# EAGLE design snes_visualization_joiner (EAGLE 6.4)
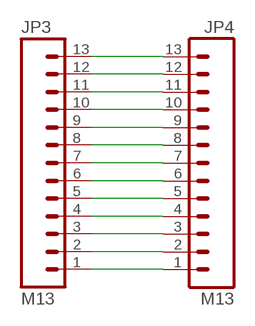
[diagram p0: schematic, sheet 1]

## Parts
JP3  M13  [1X13]
JP4  M13  [1X13]

## Nets
N$1: JP3.1 JP4.1
N$2: JP3.2 JP4.2
N$3: JP3.3 JP4.3
N$4: JP3.4 JP4.4
N$5: JP3.5 JP4.5
N$6: JP3.6 JP4.6
N$7: JP3.7 JP4.7
N$8: JP3.8 JP4.8
N$9: JP3.9 JP4.9
N$10: JP3.10 JP4.10
N$11: JP3.11 JP4.11
N$12: JP3.12 JP4.12
N$13: JP3.13 JP4.13

## Library data of the parts
JP3 JP4 = SparkFun-Connectors:M13: 13-pin single row .1" header

## Board
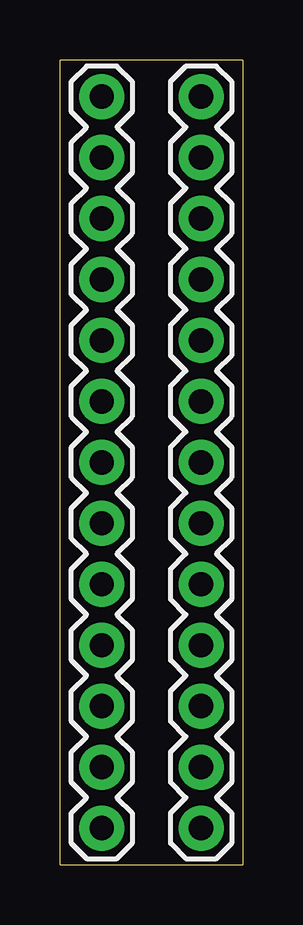
[diagram p1: board, top side]
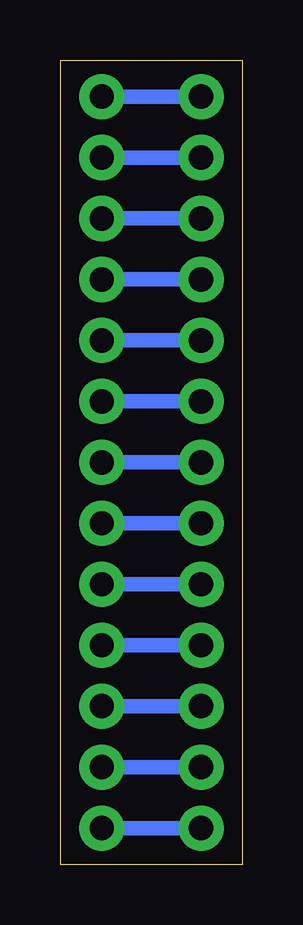
[diagram p2: board, bottom side, seen from below]

Size 7.62 x 33.53 mm. Coordinates in mm from the lower left corner, seen from the top.
Outline: 0,0 7.62,0 7.62,33.53 0,33.53 0,0
Copper layers (1*16): Top 0.035mm / dielectric 1.5mm / Bottom 0.035mm
Design rules "default": minimum track width 10mil, minimum drill 24mil, track to track 8mil, track to pad 8mil, pad to pad 8mil, via to via 8mil, smd to smd 8mil, copper to edge 40mil, drill to drill 8mil, minimum pad ring 10mil, minimum via ring 8mil, stop-mask expansion 4mil, vias tented up to drill 0mil, thermal gap 10mil

### Footprints (pad centres in the part's own frame; a part is rotated, then mirrored left to right if it is on the bottom)
1X13 = drill 1.016 pad 1.88: 1 0,0; 2 2.54,0; 3 5.08,0; 4 7.62,0; 5 10.16,0; 6 12.7,0; 7 15.24,0; 8 17.78,0; 9 20.32,0; 10 22.86,0; 11 25.4,0; 12 27.94,0; 13 30.48,0

### Placement (x,y rotation side)
JP3  1.74,1.52 90 top
JP4  5.88,1.52 90 top

### Tracks (layer width: path | path; a pad name or v marks a point on that pad's centre or on a via)
N$1
  Bottom 0.61: JP4.1 JP3.1
N$2
  Bottom 0.61: JP3.2 JP4.2
N$3
  Bottom 0.61: JP4.3 JP3.3
N$4
  Bottom 0.61: JP3.4 JP4.4
N$5
  Bottom 0.61: JP4.5 JP3.5
N$6
  Bottom 0.61: JP3.6 JP4.6
N$7
  Bottom 0.61: JP4.7 JP3.7
N$8
  Bottom 0.61: JP3.8 JP4.8
N$9
  Bottom 0.61: JP4.9 JP3.9
N$10
  Bottom 0.61: JP3.10 JP4.10
N$11
  Bottom 0.61: JP4.11 JP3.11
N$12
  Bottom 0.61: JP3.12 JP4.12
N$13
  Bottom 0.61: JP3.13 JP4.13